# EasyEDA Pro project ProPrj_（课设）太阳能板最大功率点追踪主控板 Solar MPPT Tracking controlling board_2024-09-24.epro, schematic Schematic1

## Sheets
1 Solar panel MPPT: Create Date: 2024-02-09; Page Name: Solar panel MPPT; Project Name: ELEC 3300--MPPT; Schematic Name: Schematic1; Update Date: 2024-04-17; Company: 嘉立创EDA; Page Size: A4; Version: V1.0
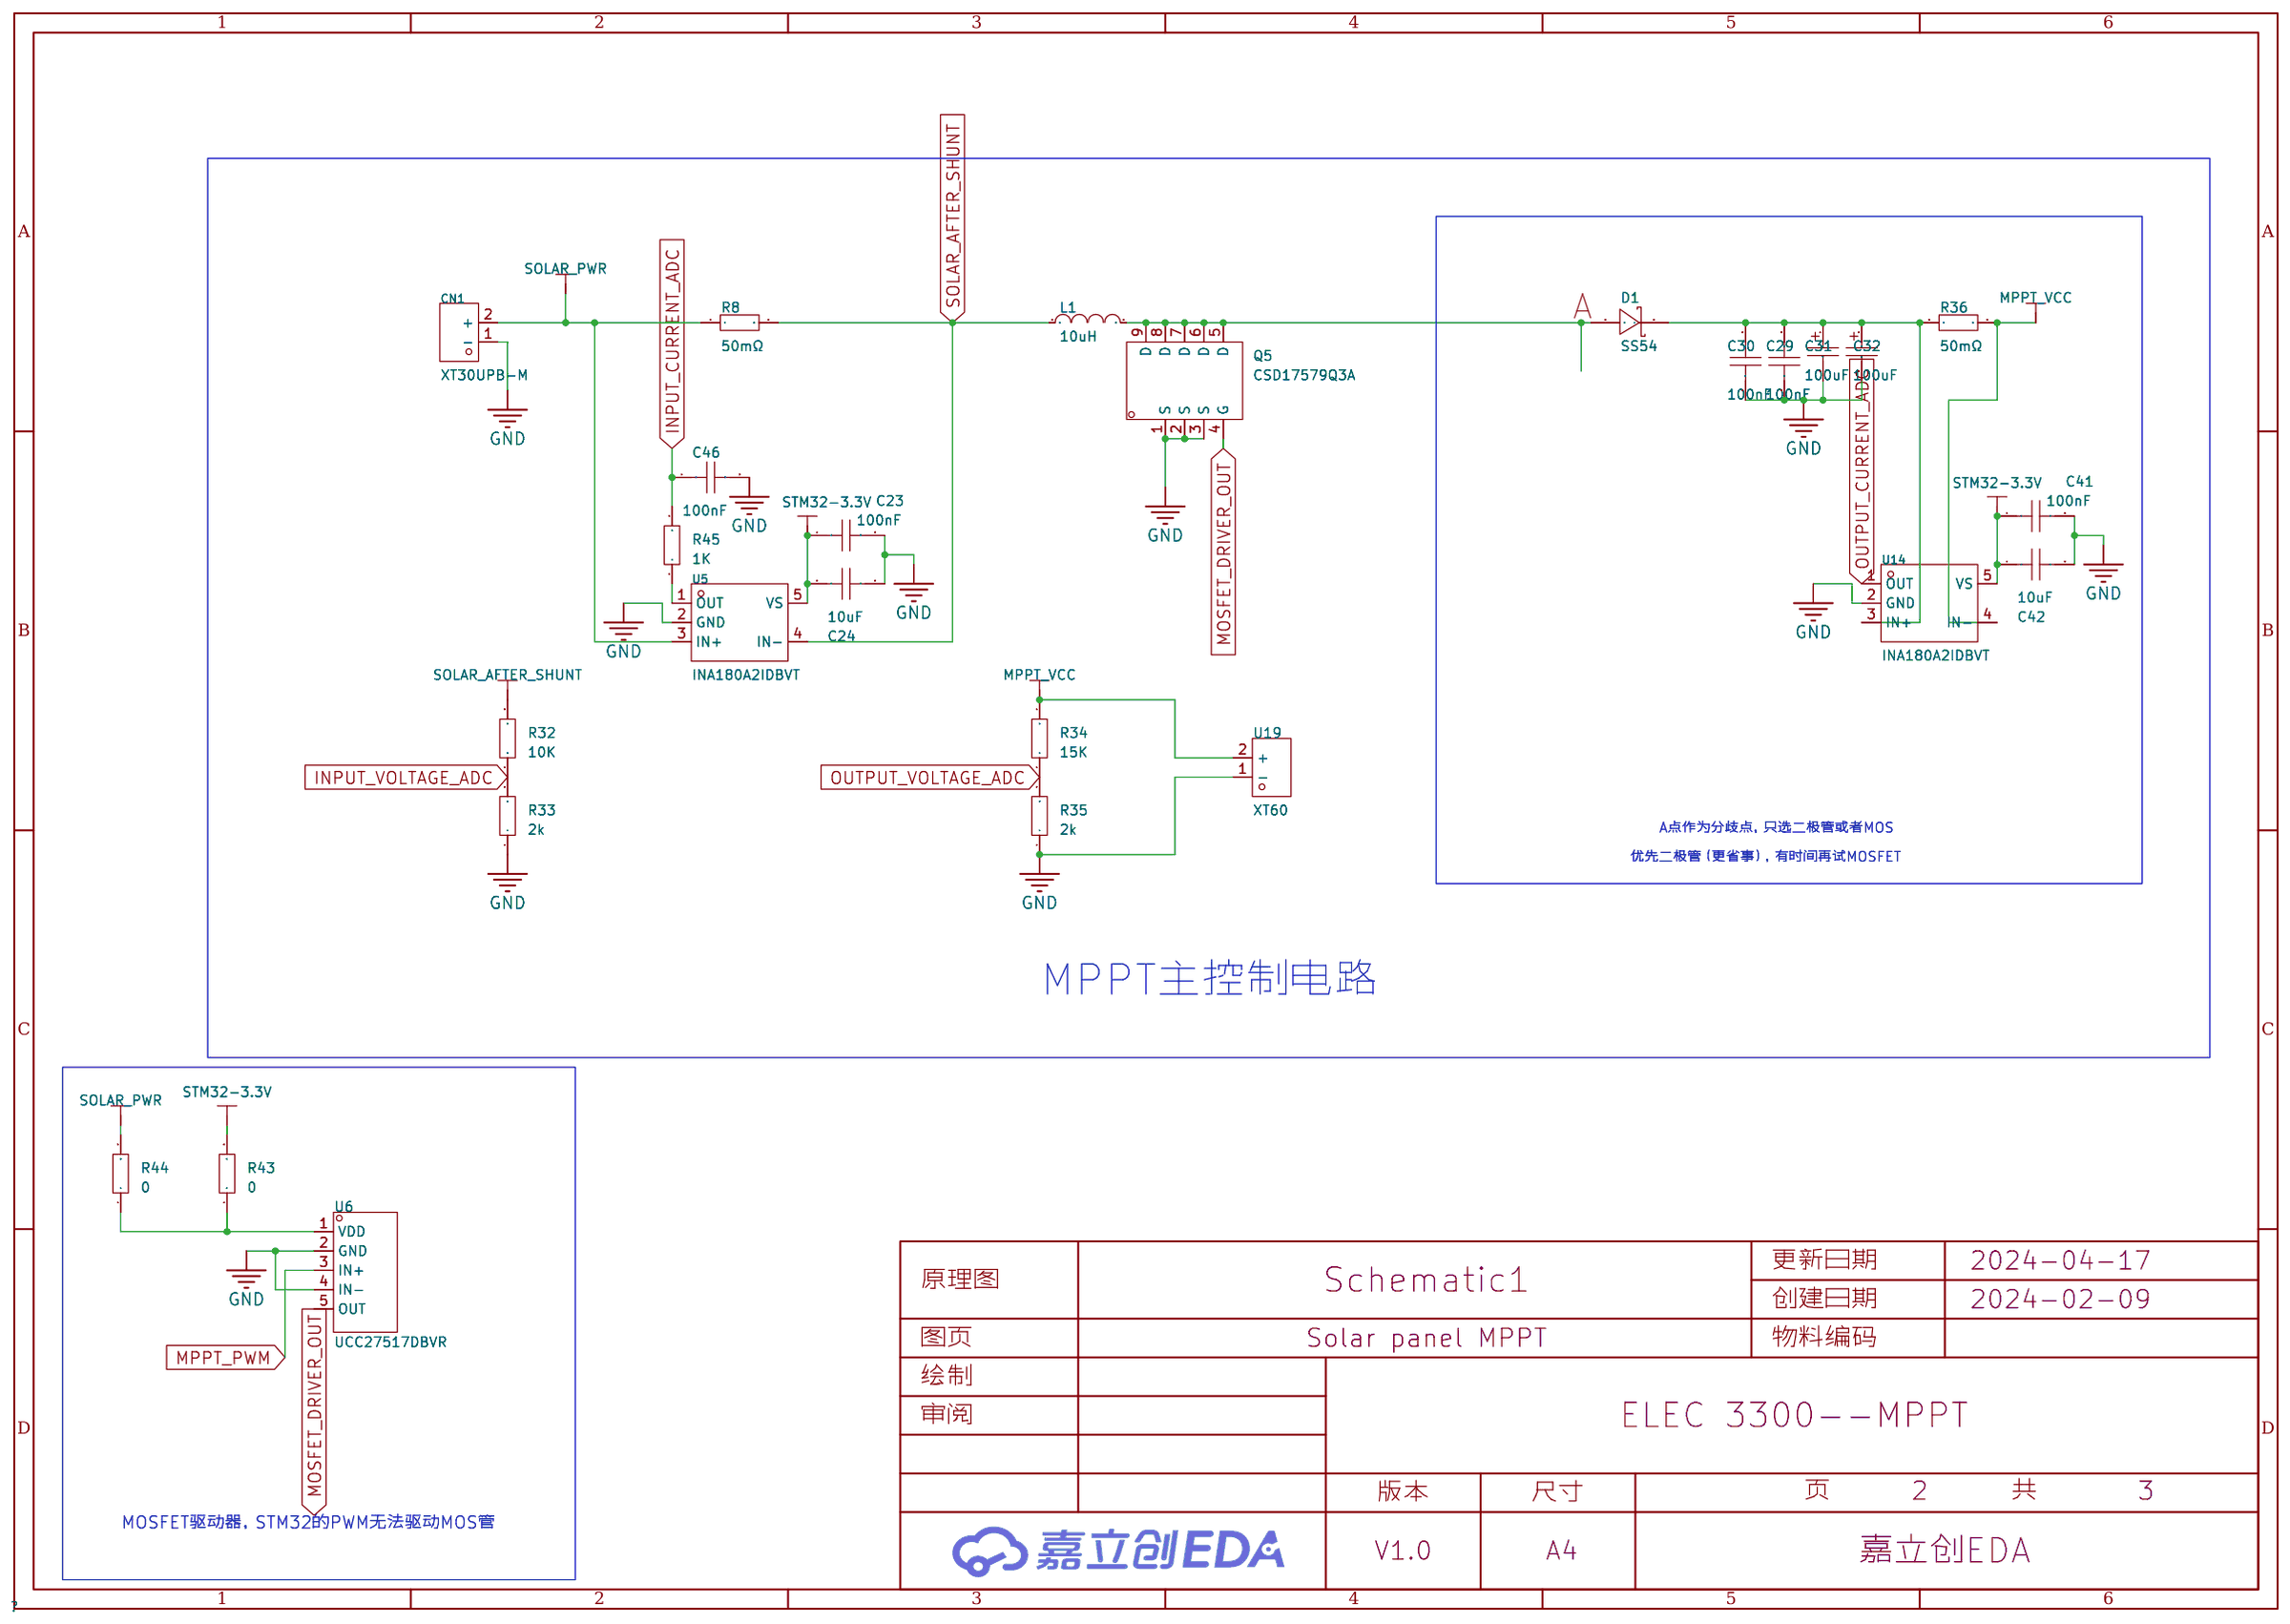
[diagram p1: Solar panel MPPT]
2 STM32 and related: Page Name: STM32 and related; Project Name: （课设）太阳能板最大功率点追踪主控板; Update Date: 2024-08-07
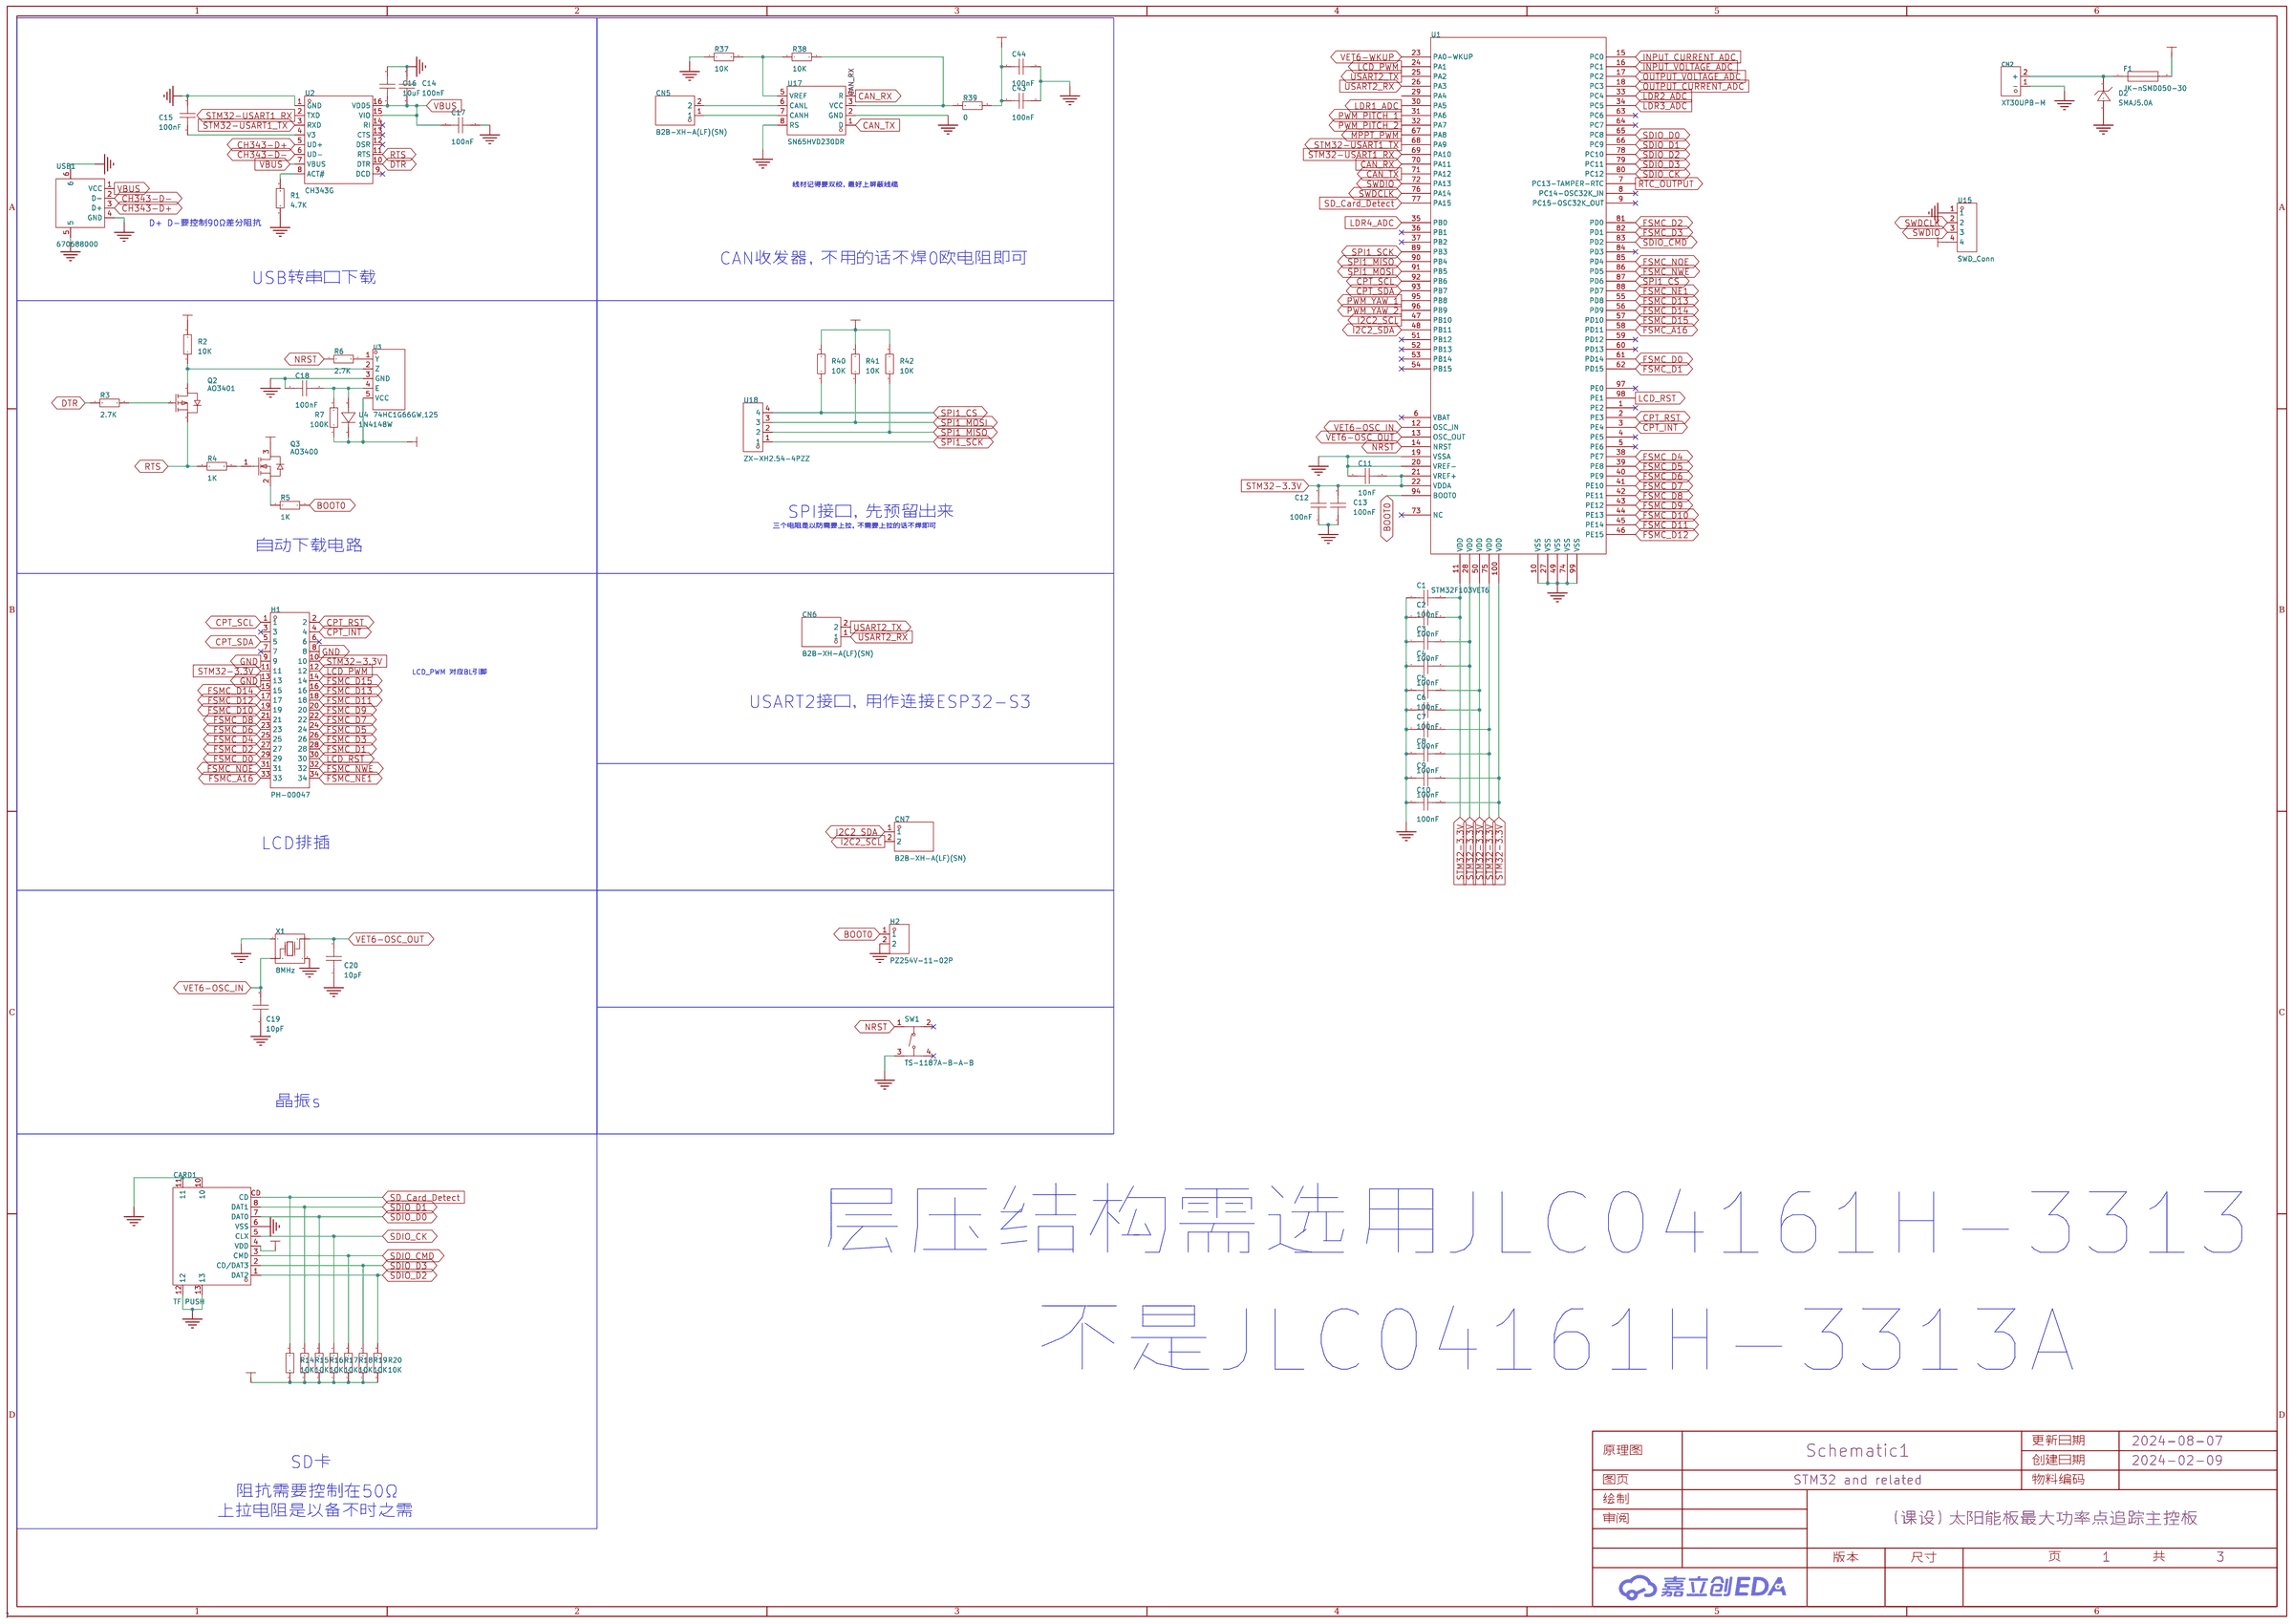
[diagram p2: STM32 and related]
3 Solar tracking control: Page Name: Solar tracking control; Update Date: 2024-04-16
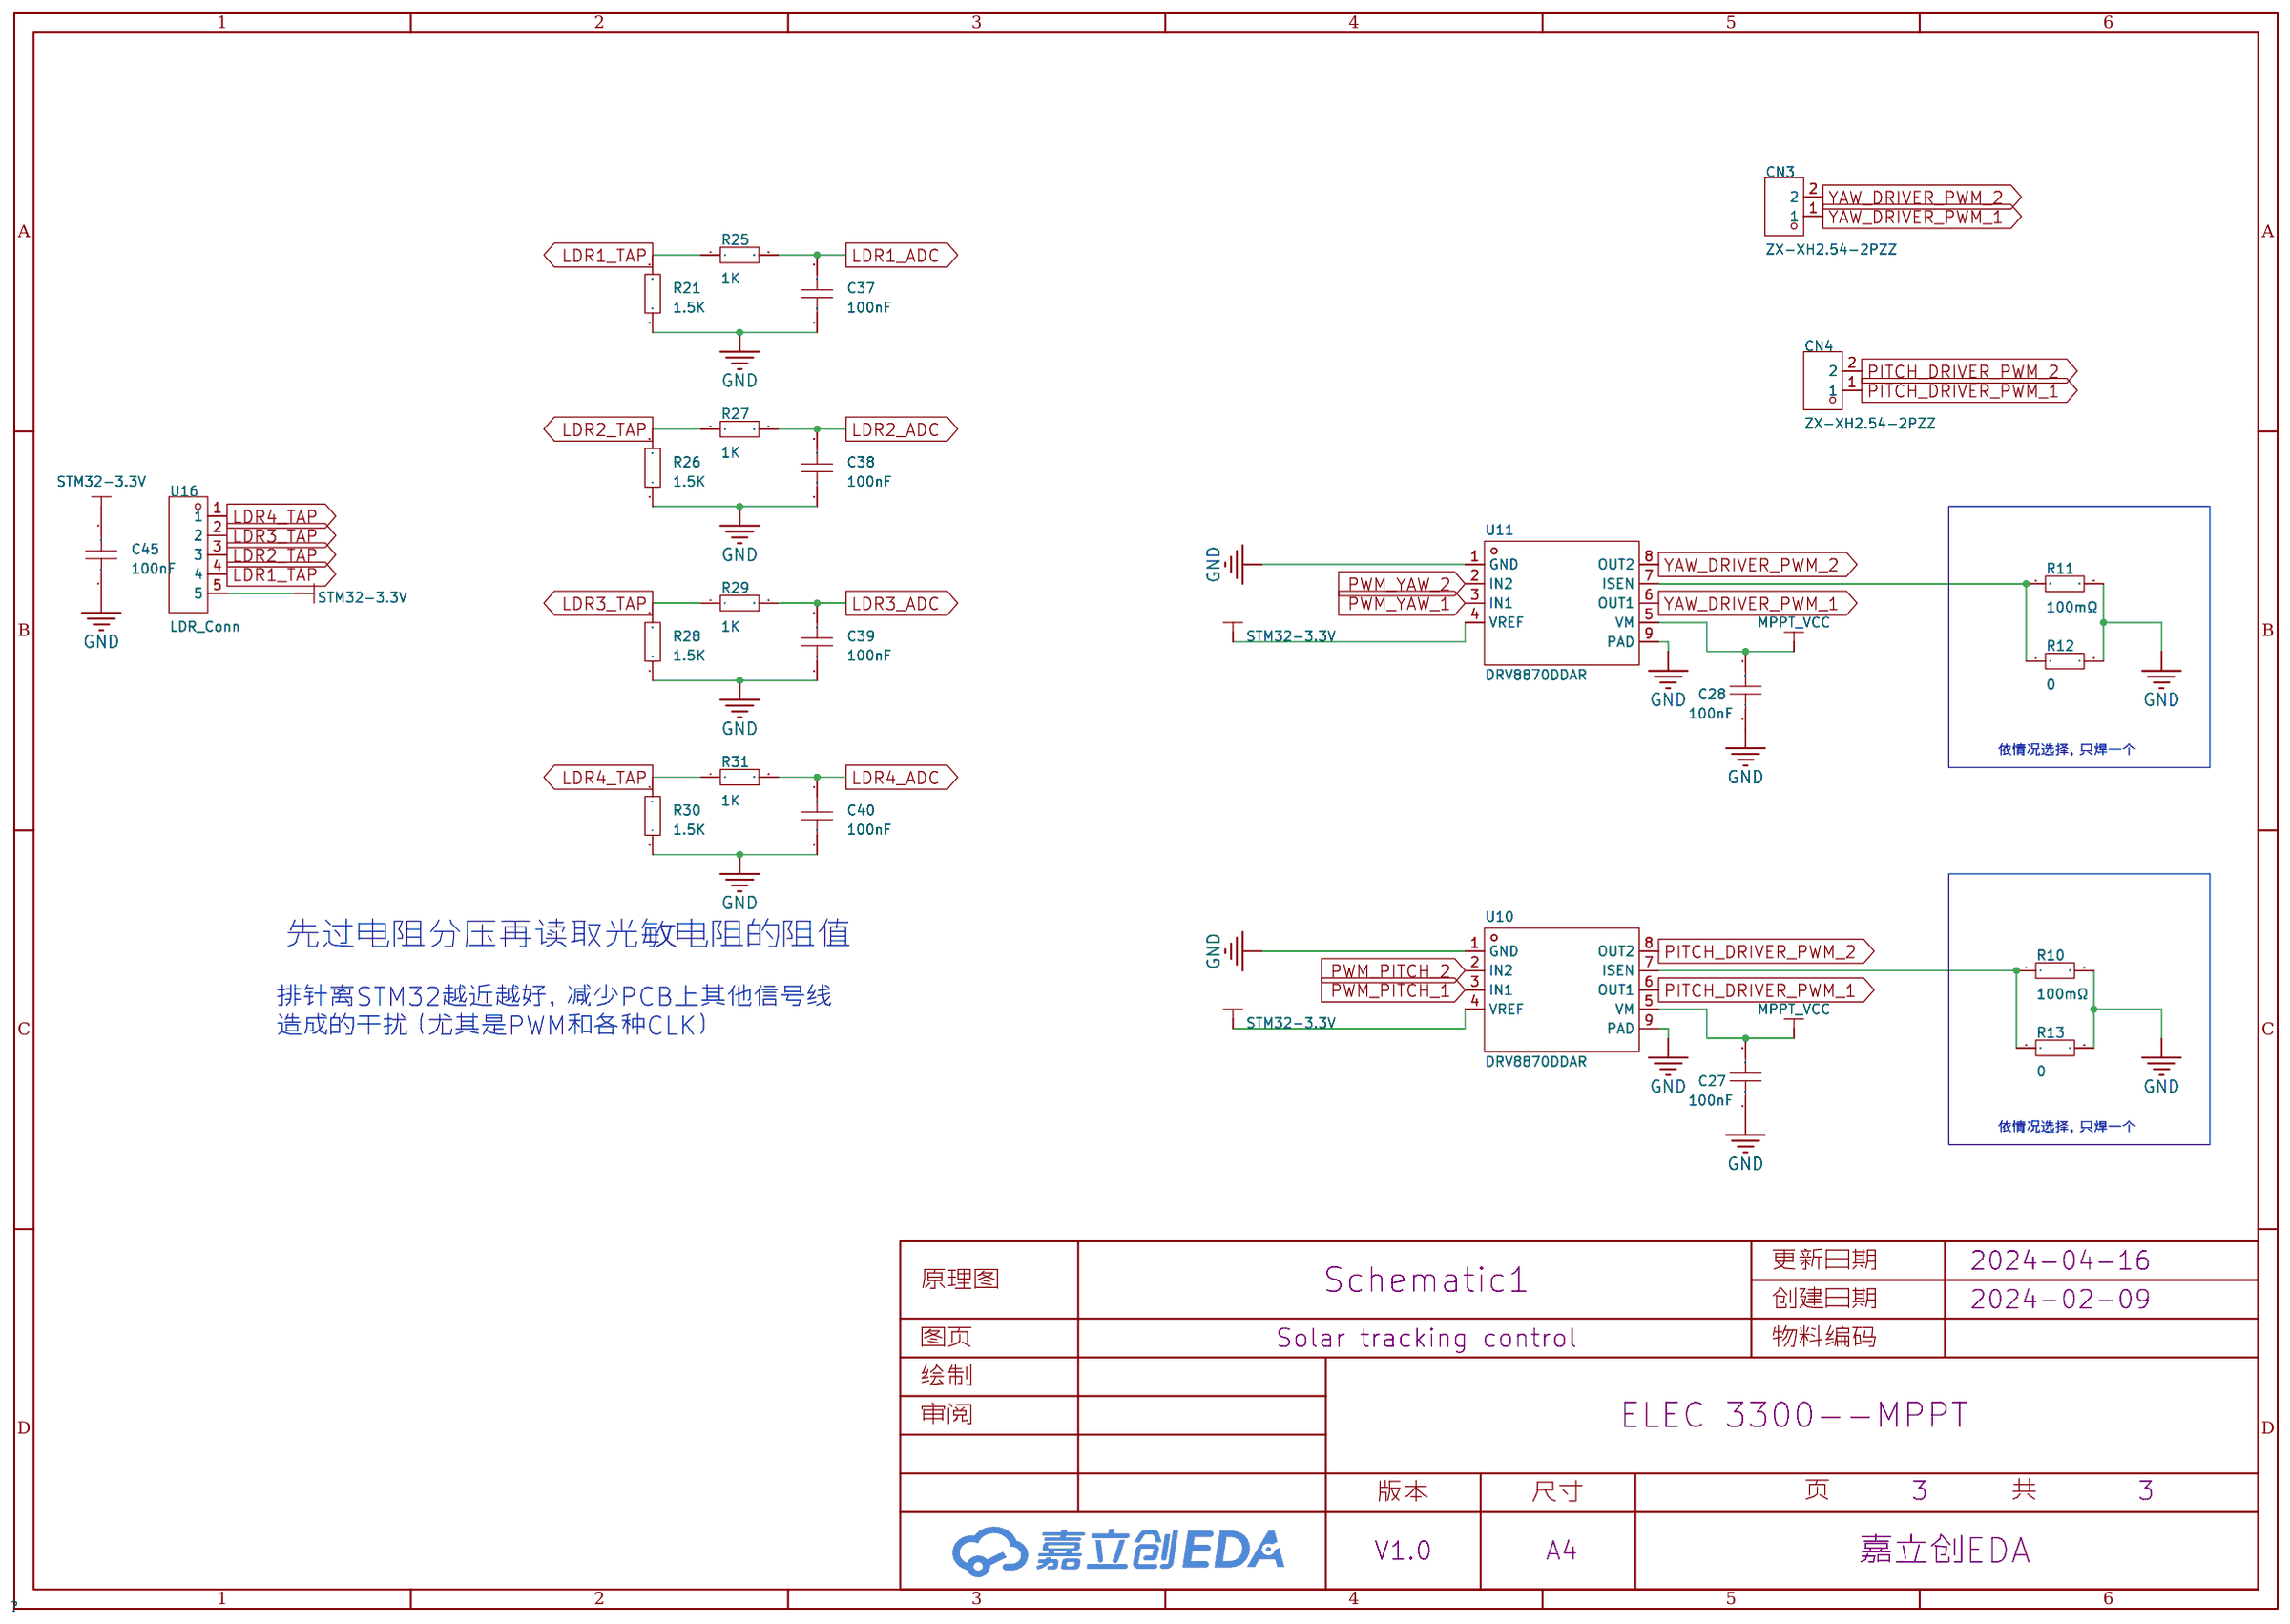
[diagram p3: Solar tracking control]

## Parts
sheet Solar panel MPPT
C23  100nF  [C0603]
C24  10uF  [C0603]
C29  100nF  [C0603]
C30  100nF  [C0603]
C31  100uF  [CASE-B_3528]
C32  100uF  [CASE-B_3528]
C41  100nF  [C0603]
C42  10uF  [C0603]
C46  100nF  [C0603]
CN1  XT30UPB-M  [CONN-TH_XT30UPB-M]
D1  SS54  [SMA_L4.4-W2.8-LS5.4-R-RD]
L1  10uH  [IND-SMD_L13.8-W12.6_SMMS1360]
Q5  CSD17579Q3A  [SON-8_L3.0-W3.1-P0.65-BP-EP]
R8  50mΩ  [RES-SMD_L6.4-W3.2-1]
R32  10K  [R0603]
R33  2k  [R0603]
R34  15K  [R0603]
R35  2k  [R0603]
R36  50mΩ  [RES-SMD_L6.4-W3.2-1]
R43  0  [R0603]
R44  0  [R0603]
R45  1K  [R0603]
U5  INA180A2IDBVT  [SOT-23-5_L3.0-W1.7-P0.95-LS2.8-BR]
U6  UCC27517DBVR  [SOT-23-5_L3.0-W1.7-P0.95-LS2.8-BR]
U14  INA180A2IDBVT  [SOT-23-5_L3.0-W1.7-P0.95-LS2.8-BR]
U19  XT60  [CONN-TH_XT60]
sheet Solar tracking control
C27  100nF  [C0603]
C28  100nF  [C0603]
C37  100nF  [C0603]
C38  100nF  [C0603]
C39  100nF  [C0603]
C40  100nF  [C0603]
C45  100nF  [C0603]
CN3  ZX-XH2.54-2PZZ  [CONN-TH_2P-P2.50_HX25003-2A]
CN4  ZX-XH2.54-2PZZ  [CONN-TH_2P-P2.50_HX25003-2A]
R10  100mΩ  [R2512]
R11  100mΩ  [R2512]
R12  0  [R0603]
R13  0  [R0603]
R21  1.5K  [R0603]
R25  1K  [R0603]
R26  1.5K  [R0603]
R27  1K  [R0603]
R28  1.5K  [R0603]
R29  1K  [R0603]
R30  1.5K  [R0603]
R31  1K  [R0603]
U10  DRV8870DDAR  [HSOP-8_L5.0-W4.0-P1.27-LS6.2-BL-EP]
U11  DRV8870DDAR  [HSOP-8_L5.0-W4.0-P1.27-LS6.2-BL-EP]
U16  LDR_Conn  [CONN-TH_5P-P2.50_ZX-XH2.54-5PZZ]
sheet STM32 and related
C1  100nF  [C0603]
C2  100nF  [C0603]
C3  100nF  [C0603]
C4  100nF  [C0603]
C5  100nF  [C0603]
C6  100nF  [C0603]
C7  100nF  [C0603]
C8  100nF  [C0603]
C9  100nF  [C0603]
C10  100nF  [C0603]
C11  10nF  [C0603]
C12  100nF  [C0603]
C13  100nF  [C0603]
C14  100nF  [C0603]
C15  100nF  [C0603]
C16  10uF  [C0603]
C17  100nF  [C0603]
C18  100nF  [C0603]
C19  10pF  [C0603]
C20  10pF  [C0603]
C43  100nF  [C0603]
C44  100nF  [C0603]
CARD1  TF PUSH  [TF-SMD_TF-PUSH]
CN2  XT30UPB-M  [CONN-TH_XT30UPB-M]
CN5  B2B-XH-A(LF)(SN)  [CONN-TH_B2B-XH-A-LF-SN]
CN6  B2B-XH-A(LF)(SN)  [CONN-TH_B2B-XH-A-LF-SN]
CN7  B2B-XH-A(LF)(SN)  [CONN-TH_B2B-XH-A-LF-SN]
D2  SMAJ5.0A  [SMA_L4.4-W2.6-LS5.0-RD]
F1  JK-nSMD050-30  [F1206]
H1  PH-00047  [HDR-TH_34P-P2.54-V-M-R2-C17-S2.54]
H2  PZ254V-11-02P  [HDR-TH_2P-P2.54-V-M]
Q2  AO3401  [SOT-23-3_L2.9-W1.4-P1.90-LS2.6-BR]
Q3  AO3400  [SOT-23_L2.9-W1.3-P1.90-LS2.4-BR]
R1  4.7K  [R0603]
R2  10K  [R0603]
R3  2.7K  [R0603]
R4  1K  [R0603]
R5  1K  [R0603]
R6  2.7K  [R0603]
R7  100K  [R0603]
R14  10K  [R0603]
R15  10K  [R0603]
R16  10K  [R0603]
R17  10K  [R0603]
R18  10K  [R0603]
R19  10K  [R0603]
R20  10K  [R0603]
R37  10K  [R0603]
R38  10K  [R0805]
R39  0  [R0603]
R40  10K  [R0603]
R41  10K  [R0603]
R42  10K  [R0603]
SW1  TS-1187A-B-A-B  [SW-SMD_4P-L5.1-W5.1-P3.70-LS6.5-TL-2]
U1  STM32F103VET6  [LQFP-100_L14.0-W14.0-P0.50-LS16.0-BL]
U2  CH343G  [SOP-16_L10.0-W3.9-P1.27-LS6.0-BL]
U3  74HC1G66GW,125  [SOT-353_L2.1-W1.3-P0.65-LS2.3-BR]
U4  1N4148W  [SOD-123_L2.8-W1.8-LS3.7-RD]
U15  SWD_Conn  [CONN-TH_4P-P2.50_4PIN]
U17  SN65HVD230DR  [SOIC-8_L4.9-W3.9-P1.27-LS6.0-BL]
U18  ZX-XH2.54-4PZZ  [CONN-TH_4P-P2.50_4PIN]
USB1  670688000  [USB-B-TH_67068-8000]
X1  8MHz  [OSC-SMD_4P-L3.2-W2.5-BL]

## Library data of the parts
C1-C20 C23 C24 C27-C30 C37-C46 = CAP_0603: Supplier Footprint: 0603
C31 C32 = TAJB107K006RNJ: 容值:100uF;精度:±10%;额定电压:6.3V;等效串联电阻:1.7Ω@100kHz;; LCSC Part Name: 100uF ±10% 6.3V; Supplier Part: C16133; Manufacturer: Kyocera AVX; Supplier Footprint: CASE-B-3528; JLCPCB Part Class: 基础库; Datasheet: https://atta.szlcsc.com/upload/public/pdf/source/20160107/1457707750344.pdf; Supplier: LCSC; Tolerance: ±10%; Rated Voltage: 6.3V; Equivalent Series Resistance(ESR): 1.7Ω@100kHz; Operating Temperature: -55℃~+125℃
CN1 CN2 = XT30UPB-M: 类别:-;类型1:-;; LCSC Part Name: AMASS(艾迈斯)板载立式 航模锂电池控制器连接器插头 公头XT30UPB-M; Supplier Part: C428721; Manufacturer: AMASS(艾迈斯); JLCPCB Part Class: 扩展库; Datasheet: https://atta.szlcsc.com/upload/public/pdf/source/20230412/7B5DFEF57C9EA5273853390C734B3AC5.pdf; Supplier: LCSC; Brand: 艾迈斯; Type: 航模插头; Colour: 黄色; RatedVoltage: DC 500V; InterfaceType: 公头; MetalMaterial: 镀金; InsulationMaterial: PA; RatedCurrent: 15A; contact resistance: 0.65mΩ
D1 = SS54_C22452: 正向压降(Vf):550mV@5A;直流反向耐压(Vr):40V;平均整流电流(Io):5A;; LCSC Part Name: 电压:40V 电流:5A; Supplier Part: C22452; Manufacturer: MDD; Supplier Footprint: SMA(DO-214AC); JLCPCB Part Class: 基础库; Datasheet: https://atta.szlcsc.com/upload/public/pdf/source/20230314/529CD85F9B31F69841D3A079BC07E377.pdf; Supplier: LCSC; Forward Voltage (Vf@If): 550mV@5A; Reverse Voltage (Vr): 40V; Average Rectified Current (Io): 5A; Reverse Leakage Current (Ir): 1mA@40V
L1 = SMMS1360-100M: 电感值:10uH;精度:±20%;额定电流:10A;饱和电流(Isat):12.5A;类型:一体成型电感;; LCSC Part Name: 10uH ±20% 12.5A; Supplier Part: C150112; Manufacturer: SXN(顺翔诺); Supplier Footprint: SMD; JLCPCB Part Class: 扩展库; Datasheet: https://atta.szlcsc.com/upload/public/pdf/source/20210810/BBF24330FB2F5029F637830BA9C42C0D.pdf; Supplier: LCSC; Tolerance: ±20%; Rated Current: 10A; Saturation Current (Isat): 12.5A; DC Resistance (DCR): 21mΩ; Type: 一体成型电感
Q5 = CSD17579Q3A: 类型:N沟道;漏源电压(Vdss):30V;连续漏极电流(Id):20A;功率(Pd):3.2W;导通电阻(RDS(on)@Vgs,Id):10.2mΩ@10V,8A;阈值电压(Vgs(th)@Id):1.9V@250uA;; LCSC Part Name: N沟道 耐压:30V 电流:20A; Supplier Part: C97376; Manufacturer: TI(德州仪器); Supplier Footprint: SON-8-EP(3.1x3); JLCPCB Part Class: 扩展库; Datasheet: https://www.ti.com/cn/lit/gpn/csd17579q3a; Supplier: LCSC; Type: N沟道; Drain Source Voltage (Vdss): 30V; Continuous Drain Current (Id): 20A; Power Dissipation (Pd): 3.2W; Drain Source On Resistance (RDS(on)@Vgs,Id): 10.2mΩ@10V,8A; Gate Threshold Voltage (Vgs(th)@Id): 1.9V@250uA
R8 R36 = FMF25FPJR050-LH: 阻值:50mΩ;精度:±1%;功率:2W;温度系数:±70ppm/℃;; LCSC Part Name: 50mΩ ±1% 2W; Supplier Part: C335239; Manufacturer: PSA(信昌电陶); Supplier Footprint: 2512; JLCPCB Part Class: 扩展库; Datasheet: https://atta.szlcsc.com/upload/public/pdf/source/20191129/C464975_5F7F8E27A15B862FFEA0BACE05AA9473.pdf; Supplier: LCSC; Tolerance: ±1%; Power(Watts): 2W; Temperature Coefficient: ±70ppm/℃
R1-R7 R12-R21 R25-R35 R37-R45 = Res_0603: Supplier Footprint: 0603
U5 U14 = INA180A2IDBVT: 放大器数:单路;; Supplier Part: C116203; Manufacturer: TI(德州仪器); Supplier Footprint: SOT-23-5; JLCPCB Part Class: 扩展库; Datasheet: https://www.ti.com/cn/lit/gpn/ina180; Supplier: LCSC; Number of Channels: 单路; Supply Current: 260uA; Operating Temperature: -40℃~+125℃
U6 = UCC27517DBVR: 驱动配置:低边;负载类型:MOSFET；IGBT;驱动通道数:1;峰值灌电流:4A;峰值拉电流:4A;电源电压:4.5V~18V;上升时间:8ns;下降时间:7ns;; Supplier Part: C99395; Manufacturer: TI(德州仪器); Supplier Footprint: SOT-23-5; JLCPCB Part Class: 扩展库; Datasheet: https://www.ti.com/cn/lit/gpn/ucc27517; Supplier: LCSC; Driven Configuration: 低边; Load Type: MOSFET；IGBT; Number of Drivers: 1; Peak Output Current(sink): 4A; Peak Output Current(source): 4A; Supply Voltage: 4.5V~18V; Rise Time: 8ns; Fall Time: 7ns; Operating Temperature: -40℃~+140℃@(Tj)
U19 = XT60: 类别:-;类型1:-;; LCSC Part Name: AMASS(艾迈斯) XT60模型插头 3.5mm镀金香蕉头公头（电调端）XT60-M; Supplier Part: C98733; Manufacturer: AMASS(艾迈斯); JLCPCB Part Class: Extended Part; Datasheet: https://atta.szlcsc.com/upload/public/pdf/source/20170606/1496716524919.pdf; Supplier: LCSC; Brand: 艾迈斯; Type: 香蕉头; Colour: 黄色; InterfaceType: 公头; specifications: 3.5mm
CN3 CN4 = ZX-XH2.54-2PZZ: 插针结构:1x2P;间距:2.54mm;安装方式:直插;参考系列:XH;总PIN数:2P;排数:1;每排PIN数:2;行距:-;额定电流:3A;触头材质:黄铜;触头镀层:锡;工作温度范围:-25℃~+85℃;; Supplier Part: C7429632; Manufacturer: Megastar(兆星); Supplier Footprint: 插件,P=2.54mm; JLCPCB Part Class: 扩展库; Datasheet: https://atta.szlcsc.com/upload/public/pdf/source/20230619/19BA6947230AA44A04D3EDD65E618FD0.pdf; Supplier: LCSC; Pins Structure: 1x2P; Pitch: 2.54mm; Mounting Style: 直插; Reference Series: XH; Number of Pins: 2P; Number of Rows: 1; Number of PINs Per Row: 2; Current Rating (Max): 3A; Contact Material: 黄铜; Contact Plating: 锡; Operating Temperature Range: -25℃~+85℃
R10 R11 = RLP25FEER100: 阻值:100mΩ;精度:±1%;功率:2W;温度系数:±50ppm/℃;; LCSC Part Name: 100mΩ ±1% 2W; Supplier Part: C160587; Manufacturer: 大毅科技; Supplier Footprint: 2512; JLCPCB Part Class: 扩展库; Datasheet: https://atta.szlcsc.com/upload/public/pdf/source/20191209/C467441_D59F70B0A5C6980F35DB1CB3CCA97CC4.pdf; Supplier: LCSC; Tolerance: ±1%; Power(Watts): 2W; Temperature Coefficient: ±50ppm/℃
U10 U11 = DRV8870DDAR: DRV8870 具有电流调节功能的 50V、3.6A、H 桥电机驱动器; Supplier Part: C86590; Manufacturer: TI(德州仪器); Supplier Footprint: HSOP-8-EP; JLCPCB Part Class: 扩展库; Datasheet: https://www.ti.com/cn/lit/gpn/drv8870; Supplier: LCSC
U16 = ZX-XH2.54-5PZZ: 插针结构:1x5P;间距:2.54mm;安装方式:直插;参考系列:XH;总PIN数:5P;排数:1;每排PIN数:5;行距:-;额定电流:3A;触头材质:黄铜;触头镀层:锡;工作温度范围:-25℃~+85℃;; Supplier Part: C7429635; Manufacturer: Megastar(兆星); Supplier Footprint: 插件,P=2.54mm; JLCPCB Part Class: Extended Part; Datasheet: https://atta.szlcsc.com/upload/public/pdf/source/20230619/60EEF4ADD558E90BFFACF5D939816781.pdf; Supplier: LCSC; Pins Structure: 1x5P; Pitch: 2.54mm; Mounting Style: 直插; Reference Series: XH; Number of Pins: 5P; Number of Rows: 1; Number of PINs Per Row: 5; Current Rating (Max): 3A; Contact Material: 黄铜; Contact Plating: 锡; Operating Temperature Range: -25℃~+85℃
CARD1 = TF PUSH: 卡连接方式:自弹式;卡类型:MicroSD卡(TF卡);连接器类型:卡座;本体最大高度:2mm;工作温度范围:-20℃~+90℃;; LCSC Part Name: 自弹式 MicroSD卡(TF卡) 卡座; Supplier Part: C393941; Manufacturer: SHOU HAN(首韩); Supplier Footprint: SMD; JLCPCB Part Class: 扩展库; Datasheet: https://atta.szlcsc.com/upload/public/pdf/source/20191011/C393941_0DDD896EE907FEB750D8B7B8982E2A67.pdf; Supplier: LCSC; Card Connection Mode: 自弹式; Card Type: MicroSD卡(TF卡); Connector Type: 卡座; Maximum Body Height: 2mm; Operating Temperature Range: -20℃~+90℃
CN5-CN7 = B2B-XH-A(LF)(SN): 插针结构:1x2P;间距:2.5mm;安装方式:-;参考系列:XH;总PIN数:2P;排数:1;每排PIN数:2;行距:-;触头材质:黄铜;; LCSC Part Name: 系列:XH 间距:2.5mm 1x2P; Supplier Part: C158012; Manufacturer: JST; Supplier Footprint: 插件,P=2.5mm; JLCPCB Part Class: 扩展库; Datasheet: https://atta.szlcsc.com/upload/public/pdf/source/20180928/C265283_F9DFEEBDB2CF642B6BDFAB4B77BD2680.pdf; Supplier: LCSC; Pins Structure: 1x2P; Pitch: 2.5mm; Reference Series: XH; Number of Pins: 2P; Number of Rows: 1; Number of PINs Per Row: 2; Contact Material: 黄铜
D2 = SMAJ5.0A_C113952: 反向截止电压(Vrwm):5V;最大钳位电压:9.2V;峰值脉冲电流(Ipp)@10/1000us:43.5A;击穿电压:6.4V;; LCSC Part Name: 单向TVS 5V截止 43.5A峰值脉冲; Supplier Part: C113952; Manufacturer: MDD; Supplier Footprint: SMA(DO-214AC); JLCPCB Part Class: 扩展库; Datasheet: https://atta.szlcsc.com/upload/public/pdf/source/20230314/4319D8044EE29783A53F6AC60595AA71.pdf; Supplier: LCSC; Reverse Stand-Off Voltage (Vrwm): 5V; Maximum Clamping Voltage: 9.2V; Peak Pulse Current (Ipp)@10/1000us: 43.5A; Breakdown Voltage: 6.4V; Reverse Leakage Current (Ir): 800uA; Type: TVS
F1 = JK-nSMD050-30: 最大电压:30V;最大电流:100A;保持电流:500mA;跳闸电流:1A;; LCSC Part Name: 30V 500mA 1206自恢复; Supplier Part: C720075; Manufacturer: JK(金科); Supplier Footprint: 1206; JLCPCB Part Class: 扩展库; Datasheet: https://atta.szlcsc.com/upload/public/pdf/source/20200810/C720075_06AF2D4541537091880CC35F0EFB49F8.pdf; Supplier: LCSC; Operating Voltage (Max): 30V; Current Rating (Max): 100A; Hold Current: 500mA; Trip Current: 1A; Power Dissipation: 600mW; Resistance - Initial (Ri) (Min): 150mΩ; Resistance - Post Trip (R1) (Max): 300mΩ; Maximum Time to Trip: 100ms; Operating Temperature: -40℃~+85℃
H1 = PH-00047: 插针结构:2x17P;间距:2.54mm;行距:2.54mm;圆针/方针:方针;安装类型:直插;排数:双排;总PIN位数:34P;额定电流:3A;额定电压:-;配合针长度:6mm;塑高:2.5mm;端接针长度:3mm;触头材质:-;工作温度范围:-40℃~+105℃;颜色:黑色;; LCSC Part Name: 间距:2.54mm 2x17P 直插 方针; Supplier Part: C2685134; Manufacturer: Liansheng(连盛); Supplier Footprint: 插件,P=2.54mm; JLCPCB Part Class: 扩展库; Datasheet: https://atta.szlcsc.com/upload/public/pdf/source/20210125/C2685134_D398009F25B9F8D917A9CE13835E66FE.pdf; Supplier: LCSC; Pin Structure: 2x17P; Pitch: 2.54mm; Row Spacing: 2.54mm; Circluar Pins/Square Pins: 方针; Mounting Type: 直插; Number of Rows: 双排; Number of Pins: 34P; Current Rating (Max): 3A; Length of Mating Pin: 6mm; Insulation Height: 2.5mm; Length of End Connection Pin: 3mm; Operating Temperature Range: -40℃~+105℃; Color: 黑色
H2 = PZ254V-11-02P: 插针结构:1x2P;间距:2.54mm;行距:-;圆针/方针:方针;安装类型:直插;排数:单排;总PIN位数:2P;额定电流:-;额定电压:-;配合针长度:6mm;塑高:2.5mm;端接针长度:3mm;触头材质:黄铜;触头镀层:-;工作温度范围:-40℃~+105℃;颜色:黑色;; LCSC Part Name: 间距:2.54mm 1x2P 直插 方针; Supplier Part: C492401; Manufacturer: XFCN(兴飞); Supplier Footprint: 插件,P=2.54mm; JLCPCB Part Class: 扩展库; Datasheet: https://atta.szlcsc.com/upload/public/pdf/source/20200309/C492401_A812433581A9B211A7FFA413ADDFF0E5.pdf; Supplier: LCSC; Pin Structure: 1x2P; Pitch: 2.54mm; Circluar Pins/Square Pins: 方针; Mounting Type: 直插; Number of Rows: 单排; Number of Pins: 2P; Length of Mating Pin: 6mm; Insulation Height: 2.5mm; Length of End Connection Pin: 3mm; Contact Material: 黄铜; Operating Temperature Range: -40℃~+105℃; Color: 黑色
Q2 = AO3401_C727156: 类型:P沟道;漏源电压(Vdss):30V;连续漏极电流(Id):4.2A;功率(Pd):350mW;导通电阻(RDS(on)@Vgs,Id):65mΩ@10V,4.2A;阈值电压(Vgs(th)@Id):1.3V@250uA;; LCSC Part Name: P沟道 耐压:30V 电流:4.2A; Supplier Part: C727156; Manufacturer: TWGMC(台湾迪嘉); Supplier Footprint: SOT-23; JLCPCB Part Class: 扩展库; Datasheet: https://atta.szlcsc.com/upload/public/pdf/source/20200827/C727156_6E081BBEEFBC6B8FEE164CB196B0AF30.pdf; Supplier: LCSC; Type: P沟道; Drain Source Voltage (Vdss): 30V; Continuous Drain Current (Id): 4.2A; Power Dissipation (Pd): 350mW; Drain Source On Resistance (RDS(on)@Vgs,Id): 65mΩ@10V,4.2A; Gate Threshold Voltage (Vgs(th)@Id): 1.3V@250uA
Q3 = AO3400_C2938367: 类型:N沟道;漏源电压(Vdss):30V;连续漏极电流(Id):5.8A;功率(Pd):1.5W;导通电阻(RDS(on)@Vgs,Id):35mΩ@10V,5.8A;阈值电压(Vgs(th)@Id):1.2V@250uA;; LCSC Part Name: N沟道 耐压:30V 电流:5.8A; Supplier Part: C2938367; Manufacturer: GOODWORK(固得沃克); Supplier Footprint: SOT-23; JLCPCB Part Class: 扩展库; Datasheet: https://atta.szlcsc.com/upload/public/pdf/source/20211229/1DE691E24B5B31BB262C463D0489A9AB.pdf; Supplier: LCSC; Type: N沟道; Drain Source Voltage (Vdss): 30V; Continuous Drain Current (Id): 5.8A; Power Dissipation (Pd): 1.5W; Drain Source On Resistance (RDS(on)@Vgs,Id): 35mΩ@10V,5.8A; Gate Threshold Voltage (Vgs(th)@Id): 1.2V@250uA; Input Capacitance (Ciss@Vds): 1.05nF@15V; Reverse Transfer Capacitance (Crss@Vds): 77pF@15V
SW1 = TS-1187A-B-A-B: 电路结构:单刀单掷;按钮形状:圆形按钮;作用力:160gf;安装方式:立贴;开关长度:5.1mm;开关宽度:5.1mm;开关高度:1.5mm;带支架:不带;触点电流:50mA;额定电压(DC):12V;绝缘电阻:-;带灯:无;机械寿命:10万次;; LCSC Part Name: 5.1*5.1*1.5mm 立贴 轻触开关; Supplier Part: C318884; Manufacturer: XKB Connectivity(中国星坤); Supplier Footprint: SMD; JLCPCB Part Class: 基础库; Datasheet: https://atta.szlcsc.com/upload/public/pdf/source/20200227/C318890_053E50208A88A7BA1965D8746000774E.pdf; Supplier: LCSC; Circuit: 单刀单掷; Actuator Style: 圆形按钮; Operating Force: 160gf; Mounting Style: 立贴; Switch Length: 5.1mm; Switch Width: 5.1mm; Switch Height: 1.5mm; Strike Gundam: 不带; Contact Current: 50mA; Voltage Rating (DC): 12V; Actuator/Cap Color: 金色; With Lamp: 无; Mechanical Life: 10万次; Operating Temperature: -30℃~+85℃
U1 = STM32F103VET6: CPU内核:CM3;程序存储容量:512KB;RAM总容量:64KB;GPIO端口数量:80;工作电压范围:2V~3.6V;CPU最大主频:72MHz;程序存储器类型:FLASH;; Supplier Part: C8308; Manufacturer: ST(意法半导体); Supplier Footprint: LQFP-100(14x14); JLCPCB Part Class: 扩展库; Datasheet: https://atta.szlcsc.com/upload/public/pdf/source/20180207/C88442_15179953708671359491.pdf; Supplier: LCSC; CPU Core: CM3; Program Storage Size: 512KB; RAM Size: 64KB; GPIO Ports Number: 80; Operating Voltage Range: 2V~3.6V; CPU Maximum Speed: 72MHz; Program Memory Type: FLASH; Operating Temperature Range: -40℃~+85℃; ADC (Bit): 12bit; DAC (Bit): 12bit; Universal Serial Bus: 有; Peripheral/Function: 看门狗；DMA；看门狗；片载温度传感器; Watchdog: 有; Infrared Data Association: 有; Low-Voltage Detect: 有; Direct Memory Access: 有; Internal Oscillator: 有
U2 = CH343G: 应用功能:-;接口协议:-;; Supplier Part: C2844153; Manufacturer: WCH(南京沁恒); Supplier Footprint: SOP-16; JLCPCB Part Class: 扩展库; Datasheet: https://atta.szlcsc.com/upload/public/pdf/source/20211010/C2846043_7FA705E1F14A2906F6A2AFA45FA28209.pdf; Supplier: LCSC
U3 = 74HC1G66GW,125: 开关电路:单刀单掷(SPST)-常开;通道数:1;导通电阻(Ron@VCC):80Ω;; Supplier Part: C18566; Manufacturer: Nexperia(安世); Supplier Footprint: SOT-353; JLCPCB Part Class: 扩展库; Datasheet: https://atta.szlcsc.com/upload/public/pdf/source/20160918/1474166836525.pdf; Supplier: LCSC; Switch Circuit: 单刀单掷(SPST)-常开; Number of Channels: 1; Supply Voltage: 2V~10V; Turn-on time: 20ns; On-State Resistance (Max): 80Ω; Turn-off time: 20ns
U4 = 1N4148W_C2099: 二极管配置:独立式;正向压降(Vf):1.25V@150mA;直流反向耐压(Vr):100V;平均整流电流(Io):150mA;功率:500mW;反向恢复时间(trr):4ns;; LCSC Part Name: 电压:100V 电流:150mA; Supplier Part: C2099; Manufacturer: CJ(江苏长电/长晶); Supplier Footprint: SOD-123; JLCPCB Part Class: Extended Part; Datasheet: https://atta.szlcsc.com/upload/public/pdf/source/20120428/1457706480199.pdf; Supplier: LCSC; Diode Configuration: 独立式; Forward Voltage (Vf@If): 1.25V@150mA; Reverse Voltage (Vr): 100V; Average Rectified Current (Io): 150mA; Power Dissipation: 500mW; Reverse Leakage Current: 1uA@75V; Reverse Recovery Time (trr): 4ns
U15 U18 = ZX-XH2.54-4PZZ: 插针结构:1x4P;间距:2.54mm;安装方式:直插;参考系列:XH;总PIN数:4P;排数:1;每排PIN数:4;行距:-;额定电流:3A;触头材质:黄铜;触头镀层:锡;工作温度范围:-25℃~+85℃;; Supplier Part: C7429634; Manufacturer: Megastar(兆星); Supplier Footprint: 插件,P=2.54mm; JLCPCB Part Class: Extended Part; Datasheet: https://atta.szlcsc.com/upload/public/pdf/source/20230619/B529A2163E0159A644AB3383D208FB03.pdf; Supplier: LCSC; Pins Structure: 1x4P; Pitch: 2.54mm; Mounting Style: 直插; Reference Series: XH; Number of Pins: 4P; Number of Rows: 1; Number of PINs Per Row: 4; Current Rating (Max): 3A; Contact Material: 黄铜; Contact Plating: 锡; Operating Temperature Range: -25℃~+85℃
U17 = SN65HVD230DR: 类型:收发器;数据速率:1Mbps;; LCSC Part Name: 1Mbps 3V~3.6V; Supplier Part: C12084; Manufacturer: TI(德州仪器); Supplier Footprint: SOIC-8; JLCPCB Part Class: 扩展库; Datasheet: https://www.ti.com/cn/lit/gpn/sn65hvd230; Supplier: LCSC; Type: 收发器; Data Rate: 1Mbps; Supply Voltage: 3V~3.6V; Operating Temperature: -40℃~+85℃
USB1 = 670688000: 连接器类型:Type-B;标准:USB 2.0;公母:母;端口数量:1;触点数量:4P;; LCSC Part Name: Type-B 母; Supplier Part: C114097; Manufacturer: MOLEX; Supplier Footprint: 插件; JLCPCB Part Class: 扩展库; Datasheet: https://atta.szlcsc.com/upload/public/pdf/source/20170606/1496716487569.pdf; Supplier: LCSC; Connector Type: Type-B; Standard: USB 2.0; Gender: 母; Number of Ports: 1; Number of Contacts: 4P
X1 = TAXM8M4RDBCCT2T: 晶振类型:贴片晶振;频率:8MHz;常温频差:±10ppm;外接负载电容:10pF;频率稳定度(全温):±15ppm;; LCSC Part Name: 8MHz ±10ppm 10pF; Supplier Part: C400090; Manufacturer: YJX(雅晶鑫); Supplier Footprint: SMD3225-4P; JLCPCB Part Class: 扩展库; Datasheet: https://atta.szlcsc.com/upload/public/pdf/source/20190626/C400090_CF95B89E745AFE4EF2E392EF8AC009D6.pdf; Supplier: LCSC; Crystal Type: 贴片晶振; Normal temperature Frequency Tolerance: ±10ppm; External load capacitor: 10pF; Frequency Stability(Full temperature range): ±15ppm; Equivalent Series Resistance (ESR): 250Ω; Operating Temperature: -40℃~+85℃

## Nets
GND: C1.1 C2.1 C3.1 C4.1 C5.1 C6.1 C7.1 C8.1 C9.1 C10.1 C11.1 C12.1 C13.1 C14.2 C15.2 C16.2 C17.2 C18.1 C19.1 C20.1 C23.2 C24.2 C27.1 C28.1 C29.1 C30.1 C31.2 C32.2 C37.1 C38.1 C39.1 C40.1 C41.2 C42.2 C43.1 C44.1 C45.1 C46.2 CARD1.6(VSS) CARD1.10 CARD1.11 CARD1.12 CARD1.13 CN1.1(-) CN2.1(-) D2.2 H1.8 H1.9 H1.13 H2.2 Q5.1(S) Q5.2(S) Q5.3(S) R1.1 R10.2 R11.2 R12.2 R13.2 R21.1 R26.1 R28.1 R30.1 R33.1 R35.1 R37.1 SW1.3(C) U1.10(VSS) U1.19(VSSA) U1.20(VREF-) U1.27(VSS) U1.49(VSS) U1.74(VSS) U1.99(VSS) U2.1(GND) U3.3(GND) U5.2(GND) U6.2(GND) U6.4(IN-) U10.1(GND) U10.9(PAD) U11.1(GND) U11.9(PAD) U14.2(GND) U15.1 U17.2(GND) U17.8(RS) U19.1(-) USB1.4(GND) USB1.5 USB1.6 X1.2 X1.4
VBUS: C14.1 C16.1 C17.1 U2.7(VBUS) U2.15(VIO) U2.16(VDD5) USB1.1(VCC)
BOOT0: H2.1 R5.2 U1.94(BOOT0)
CAN_RX: U1.70(PA11) U17.4(R)
CAN_TX: U1.71(PA12) U17.1(D)
CH343-D+: U2.5(UD+) USB1.3(D+)
CH343-D-: U2.6(UD-) USB1.2(D-)
CPT_INT: H1.4 U1.3(PE4)
CPT_RST: H1.2 U1.2(PE3)
CPT_SCL: H1.1 U1.92(PB6)
CPT_SDA: H1.5 U1.93(PB7)
DTR: R3.1 U2.10(DTR)
FSMC_A16: H1.33 U1.58(PD11)
FSMC_D0: H1.29 U1.61(PD14)
FSMC_D1: H1.28 U1.62(PD15)
FSMC_D2: H1.27 U1.81(PD0)
FSMC_D3: H1.26 U1.82(PD1)
FSMC_D4: H1.25 U1.38(PE7)
FSMC_D5: H1.24 U1.39(PE8)
FSMC_D6: H1.23 U1.40(PE9)
FSMC_D7: H1.22 U1.41(PE10)
FSMC_D8: H1.21 U1.42(PE11)
FSMC_D9: H1.20 U1.43(PE12)
FSMC_D10: H1.19 U1.44(PE13)
FSMC_D11: H1.18 U1.45(PE14)
FSMC_D12: H1.17 U1.46(PE15)
FSMC_D13: H1.16 U1.55(PD8)
FSMC_D14: H1.15 U1.56(PD9)
FSMC_D15: H1.14 U1.57(PD10)
FSMC_NE1: H1.34 U1.88(PD7)
FSMC_NOE: H1.31 U1.85(PD4)
FSMC_NWE: H1.32 U1.86(PD5)
I2C2_SCL: CN7.2 U1.47(PB10)
I2C2_SDA: CN7.1 U1.48(PB11)
INPUT_CURRENT_ADC: C46.1 R45.2 U1.15(PC0)
INPUT_VOLTAGE_ADC: R32.1 R33.2 U1.16(PC1)
LCD_PWM: H1.12 U1.24(PA1)
LCD_RST: H1.30 U1.98(PE1)
LDR1_ADC: C37.2 R25.2 U1.30(PA5)
LDR1_TAP: R21.2 R25.1 U16.4
LDR2_ADC: C38.2 R27.2 U1.33(PC4)
LDR2_TAP: R26.2 R27.1 U16.3
LDR3_ADC: C39.2 R29.2 U1.34(PC5)
LDR3_TAP: R28.2 R29.1 U16.2
LDR4_ADC: C40.2 R31.2 U1.35(PB0)
LDR4_TAP: R30.2 R31.1 U16.1
MOSFET_DRIVER_OUT: Q5.4(G) U6.5(OUT)
MPPT_PWM: U1.67(PA8) U6.3(IN+)
MPPT_VCC: C27.2 C28.2 R34.2 R36.2 U10.5(VM) U11.5(VM) U14.4(IN-) U19.2(+)
NRST: R6.1 SW1.1(A) U1.14(NRST)
OUTPUT_CURRENT_ADC: U1.18(PC3) U14.1(OUT)
OUTPUT_VOLTAGE_ADC: R34.1 R35.2 U1.17(PC2)
PITCH_DRIVER_PWM_1: CN4.1 U10.6(OUT1)
PITCH_DRIVER_PWM_2: CN4.2 U10.8(OUT2)
PWM_PITCH_1: U1.31(PA6) U10.3(IN1)
PWM_PITCH_2: U1.32(PA7) U10.2(IN2)
PWM_YAW_1: U1.95(PB8) U11.3(IN1)
PWM_YAW_2: U1.96(PB9) U11.2(IN2)
RTC_OUTPUT: U1.7(PC13-TAMPER-RTC)
RTS: Q2.2(S) R4.1 U2.11(RTS)
SD_Card_Detect: CARD1.CD R14.2 U1.77(PA15)
SDIO_CK: CARD1.5(CLX) R17.2 U1.80(PC12)
SDIO_CMD: CARD1.3(CMD) R18.2 U1.83(PD2)
SDIO_D0: CARD1.7(DAT0) R16.2 U1.65(PC8)
SDIO_D1: CARD1.8(DAT1) R15.2 U1.66(PC9)
SDIO_D2: CARD1.1(DAT2) R20.2 U1.78(PC10)
SDIO_D3: CARD1.2(CD/DAT3) R19.2 U1.79(PC11)
SOLAR_AFTER_SHUNT: L1.1 R8.2 R32.2 U5.4(IN-)
SOLAR_PWR: CN1.2(+) R8.1 R44.2 U5.3(IN+)
SPI1_CS: R40.1 U1.87(PD6) U18.4
SPI1_MISO: R42.1 U1.90(PB4) U18.2
SPI1_MOSI: R41.1 U1.91(PB5) U18.3
SPI1_SCK: U1.89(PB3) U18.1
STM32-3.3V: C1.2 C2.2 C3.2 C4.2 C5.2 C6.2 C7.2 C8.2 C9.2 C10.2 C11.2 C12.2 C13.2 C23.1 C24.1 C41.1 C42.1 C43.2 C44.2 C45.2 CARD1.4(VDD) F1.2 H1.10 H1.11 Q3.3(D) R2.2 R7.1 R14.1 R15.1 R16.1 R17.1 R18.1 R19.1 R20.1 R39.2 R40.2 R41.2 R42.2 R43.2 U1.11(VDD) U1.21(VREF+) U1.22(VDDA) U1.28(VDD) U1.50(VDD) U1.75(VDD) U1.100(VDD) U3.5(VCC) U4.1(K) U5.5(VS) U10.4(VREF) U11.4(VREF) U14.5(VS) U15.4 U16.5
STM32-USART1_RX: U1.69(PA10) U2.2(TXD)
STM32-USART1_TX: U1.68(PA9) U2.3(RXD)
SWDCLK: U1.76(PA14) U15.2
SWDIO: U1.72(PA13) U15.3
USART2_RX: CN6.1 U1.26(PA3)
USART2_TX: CN6.2 U1.25(PA2)
VET6-OSC_IN: C19.2 U1.12(OSC_IN) X1.1
VET6-OSC_OUT: C20.2 U1.13(OSC_OUT) X1.3
VET6-WKUP: U1.23(PA0-WKUP)
YAW_DRIVER_PWM_1: CN3.1 U11.6(OUT1)
YAW_DRIVER_PWM_2: CN3.2 U11.8(OUT2)
$1N2269: D1.1(A) L1.2 Q5.5(D) Q5.6(D) Q5.7(D) Q5.8(D) Q5.9(D)
$1N6591: C29.2 C30.2 C31.1 C32.1 D1.2(K) R36.1 U14.3(IN+)
$1N8545: R43.1 R44.1 U6.1(VDD)
$1N9784: R45.1 U5.1(OUT)
$2N3481: C15.1 U2.4(V3)
$2N3665: R1.2 U2.8(ACT#)
$2N4610: Q2.1(G) R3.2
$2N4710: Q3.1(G) R4.2
$2N4796: Q3.2(S) R5.1
$2N4863: Q2.3(D) R2.1 U3.2(Z)
$2N4911: R6.2 U3.1(Y)
$2N5163: C18.2 R7.2 U3.4(E) U4.2(A)
$2N39851: CN5.2 U17.6(CANL)
$2N39854: CN5.1 U17.7(CANH)
$2N40189: R37.2 R38.1 U17.5(VREF)
$2N40263: R38.2 R39.1 U17.3(VCC)
$2N54361: CN2.2(+) D2.1 F1.1
$3N926: R11.1 R12.1 U11.7(ISEN)
$3N1009: R10.1 R13.1 U10.7(ISEN)

Not connected (* = marked no-connect by the designer): H1 3* 6* 7*; SW1 2(B)* 4(D)*; U1 1(PE2)* 4(PE5)* 5(PE6)* 6(VBAT)* 8(PC14-OSC32K_IN)* 9(PC15-OSC32K_OUT)* 29(PA4) 36(PB1)* 37(PB2)* 51(PB12)* 52(PB13)* 53(PB14)* 54(PB15)* 59(PD12)* 60(PD13)* 63(PC6)* 64(PC7)* 73(NC)* 84(PD3)* 97(PE0)*; U2 9(DCD)* 12(DSR)* 13(CTS)* 14(RI)*

## Notes on the sheets
sheet 1
- A
- A点作为分歧点，只选二极管或者MOS
- 优先二极管（更省事），有时间再试MOSFET
- MPPT主控制电路
- MOSFET驱动器，STM32的PWM无法驱动MOS管
sheet 2
- 线材记得要双绞，最好上屏蔽线缆
- D+ D-要控制90Ω差分阻抗
- CAN收发器，不用的话不焊0欧电阻即可
- USB转串口下载
- SPI接口，先预留出来
- 三个电阻是以防需要上拉，不需要上拉的话不焊即可
- 自动下载电路
- LCD_PWM 对应BL引脚
- USART2接口，用作连接ESP32-S3
- LCD排插
- 晶振s
- 层压结构需选用JLC04161H-3313
- 不是JLC04161H-3313A
- SD卡
- 阻抗需要控制在50Ω
- 上拉电阻是以备不时之需
sheet 3
- 依情况选择，只焊一个
- 先过电阻分压再读取光敏电阻的阻值
- 排针离STM32越近越好，减少PCB上其他信号线
  造成的干扰（尤其是PWM和各种CLK）
- 依情况选择，只焊一个
